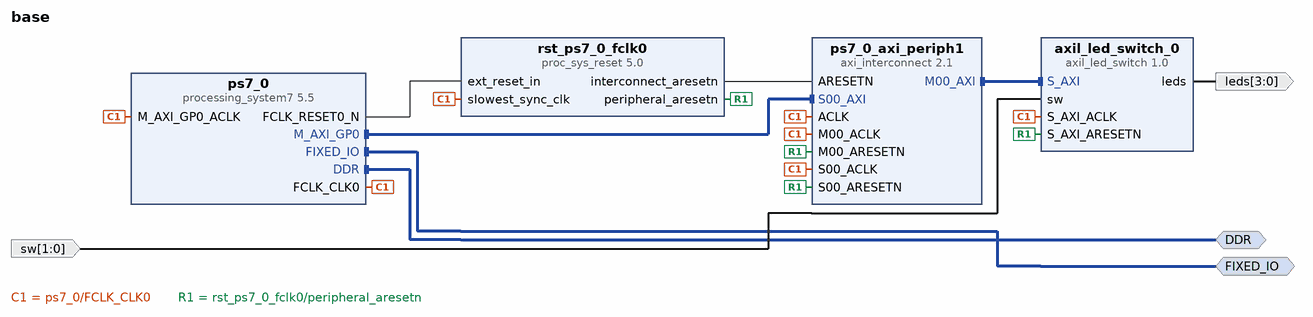
[diagram p0: block diagram of the top level]
# Vivado block design base, xc7z020clg400-1, Vivado 2020.1
create_bd_design base

create_bd_intf_port -mode Master -vlnv xilinx.com:interface:ddrx_rtl:1.0 DDR
create_bd_intf_port -mode Master -vlnv xilinx.com:display_processing_system7:fixedio_rtl:1.0 FIXED_IO
create_bd_port -dir I -from 1 -to 0 sw
create_bd_port -dir O -from 3 -to 0 leds

create_bd_cell -type ip -vlnv xilinx.com:ip:processing_system7:5.5 ps7_0
set_property -dict [list \
  CONFIG.PCW_APU_PERIPHERAL_FREQMHZ 650 \
  CONFIG.PCW_CRYSTAL_PERIPHERAL_FREQMHZ 50 \
  CONFIG.PCW_ENET0_ENET0_IO {MIO 16 .. 27} \
  CONFIG.PCW_ENET0_GRP_MDIO_ENABLE 1 \
  CONFIG.PCW_ENET0_GRP_MDIO_IO {MIO 52 .. 53} \
  CONFIG.PCW_ENET0_PERIPHERAL_ENABLE 1 \
  CONFIG.PCW_FCLK_CLK0_BUF FALSE \
  CONFIG.PCW_FPGA0_PERIPHERAL_FREQMHZ 100 \
  CONFIG.PCW_FPGA1_PERIPHERAL_FREQMHZ 142 \
  CONFIG.PCW_FPGA2_PERIPHERAL_FREQMHZ 200 \
  CONFIG.PCW_FPGA3_PERIPHERAL_FREQMHZ 100 \
  CONFIG.PCW_GPIO_MIO_GPIO_ENABLE 0 \
  CONFIG.PCW_I2C0_GRP_INT_ENABLE 1 \
  CONFIG.PCW_I2C0_GRP_INT_IO EMIO \
  CONFIG.PCW_I2C0_I2C0_IO {MIO 50 .. 51} \
  CONFIG.PCW_I2C0_PERIPHERAL_ENABLE 1 \
  CONFIG.PCW_I2C_PERIPHERAL_FREQMHZ 108.333336 \
  CONFIG.PCW_PERIPHERAL_BOARD_PRESET part0 \
  CONFIG.PCW_PRESET_BANK1_VOLTAGE {LVCMOS 1.8V} \
  CONFIG.PCW_QSPI_PERIPHERAL_ENABLE 0 \
  CONFIG.PCW_SD0_GRP_CD_ENABLE 1 \
  CONFIG.PCW_SD0_GRP_CD_IO {MIO 47} \
  CONFIG.PCW_SD0_GRP_WP_ENABLE 0 \
  CONFIG.PCW_SD0_PERIPHERAL_ENABLE 1 \
  CONFIG.PCW_SD0_SD0_IO {MIO 40 .. 45} \
  CONFIG.PCW_SDIO_PERIPHERAL_FREQMHZ 50 \
  CONFIG.PCW_UART0_PERIPHERAL_ENABLE 1 \
  CONFIG.PCW_UART0_UART0_IO {MIO 14 .. 15} \
  CONFIG.PCW_UART1_PERIPHERAL_ENABLE 0 \
  CONFIG.PCW_UART_PERIPHERAL_FREQMHZ 100 \
  CONFIG.PCW_UIPARAM_DDR_BUS_WIDTH {16 Bit} \
  CONFIG.PCW_UIPARAM_DDR_FREQ_MHZ 525 \
  CONFIG.PCW_UIPARAM_DDR_PARTNO Custom \
  CONFIG.PCW_USB0_PERIPHERAL_ENABLE 0 \
] [get_bd_cells ps7_0]
# 471 more settings of ps7_0 are not shown: defaults, MIO pin electricals, DDR timing, and values the tool derives
create_bd_cell -type ip -vlnv xilinx.com:ip:proc_sys_reset:5.0 rst_ps7_0_fclk0
create_bd_cell -type ip -vlnv xilinx.com:ip:axi_interconnect:2.1 ps7_0_axi_periph1
set_property -dict [list \
  CONFIG.M00_HAS_REGSLICE 1 \
  CONFIG.M01_HAS_REGSLICE 1 \
  CONFIG.M02_HAS_REGSLICE 1 \
  CONFIG.M03_HAS_REGSLICE 1 \
  CONFIG.M04_HAS_REGSLICE 1 \
  CONFIG.M05_HAS_REGSLICE 1 \
  CONFIG.M06_HAS_REGSLICE 1 \
  CONFIG.M07_HAS_REGSLICE 1 \
  CONFIG.M08_HAS_REGSLICE 1 \
  CONFIG.M09_HAS_REGSLICE 1 \
  CONFIG.NUM_MI 1 \
  CONFIG.S00_HAS_REGSLICE 1 \
] [get_bd_cells ps7_0_axi_periph1]
create_bd_cell -type ip -vlnv xilinx.com:user:axil_led_switch:1.0 axil_led_switch_0

# ---- connections ----

connect_bd_intf_net -intf_net processing_system7_0_FIXED_IO [get_bd_intf_ports FIXED_IO] [get_bd_intf_pins ps7_0/FIXED_IO]
connect_bd_intf_net [get_bd_intf_pins ps7_0/M_AXI_GP0] [get_bd_intf_pins ps7_0_axi_periph1/S00_AXI]
connect_bd_intf_net [get_bd_intf_ports DDR] [get_bd_intf_pins ps7_0/DDR]
connect_bd_intf_net [get_bd_intf_pins ps7_0_axi_periph1/M00_AXI] [get_bd_intf_pins axil_led_switch_0/S_AXI]
connect_bd_net [get_bd_pins ps7_0/FCLK_CLK0] \
  [get_bd_pins rst_ps7_0_fclk0/slowest_sync_clk] [get_bd_pins ps7_0/M_AXI_GP0_ACLK] [get_bd_pins ps7_0_axi_periph1/ACLK] \
  [get_bd_pins ps7_0_axi_periph1/M00_ACLK] [get_bd_pins ps7_0_axi_periph1/S00_ACLK] \
  [get_bd_pins axil_led_switch_0/S_AXI_ACLK]
connect_bd_net [get_bd_pins ps7_0/FCLK_RESET0_N] [get_bd_pins rst_ps7_0_fclk0/ext_reset_in]
connect_bd_net [get_bd_pins rst_ps7_0_fclk0/peripheral_aresetn] \
  [get_bd_pins ps7_0_axi_periph1/S00_ARESETN] [get_bd_pins ps7_0_axi_periph1/M00_ARESETN] \
  [get_bd_pins axil_led_switch_0/S_AXI_ARESETN]
connect_bd_net [get_bd_pins rst_ps7_0_fclk0/interconnect_aresetn] [get_bd_pins ps7_0_axi_periph1/ARESETN]
connect_bd_net -net sw_0_1 [get_bd_ports sw] [get_bd_pins axil_led_switch_0/sw]
connect_bd_net [get_bd_pins axil_led_switch_0/leds] [get_bd_ports leds]
set_property HDL_ATTRIBUTE.BMM_INFO_PROCESSOR {arm > base iop_pmoda/mb_bram_ctrl base iop_pmodb/mb_bram_ctrl base iop_arduino/mb_bram_ctrl base iop_rpi/mb_bram_ctrl} [get_bd_cells ps7_0]
set_property HDL_ATTRIBUTE.KEEP_HIERARCHY yes [get_bd_cells ps7_0]
set_property PFM.AXI_PORT {  S_AXI_ACP {memport "S_AXI_ACP"}  S_AXI_HP1 {memport "S_AXI_HP"}  S_AXI_HP3 {memport "S_AXI_HP"}  } [get_bd_cells ps7_0]
set_property PFM.CLOCK {  FCLK_CLK0 {id "0" is_default "true"  proc_sys_reset "rst_ps7_0_fclk0" status "fixed"}  FCLK_CLK1 {id "1" is_default "false"  proc_sys_reset "rst_ps7_0_fclk1" status "fixed"}  FCLK_CLK3 {id "3" is_default "false"  proc_sys_reset "rst_ps7_0_fclk3" status "fixed"}  } [get_bd_cells ps7_0]

# ---- address map ----
assign_bd_address -offset 0x43C00000 -range 64K -target_address_space [get_bd_addr_spaces ps7_0/Data] [get_bd_addr_segs axil_led_switch_0/S_AXI/reg0]

validate_bd_design
save_bd_design
